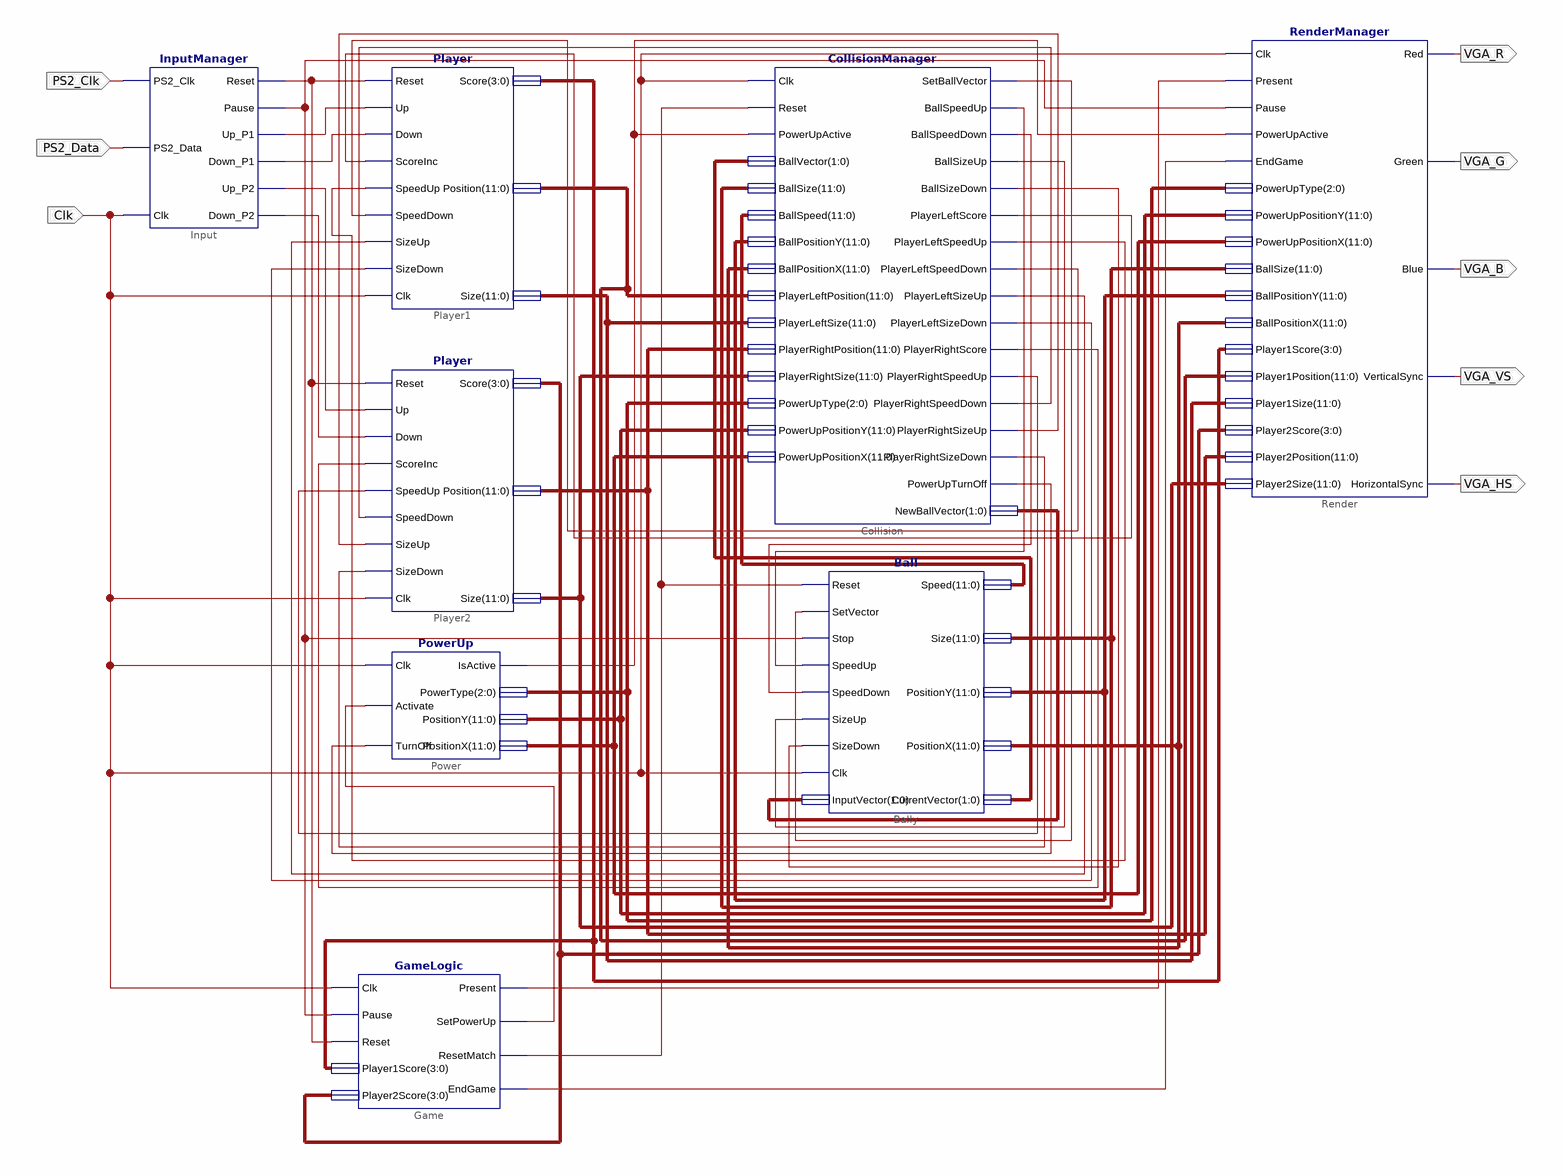
[diagram p0: schematic sheet 1]
// Xilinx ISE schematic pong.sch (spartan3e) as structural Verilog: 8 symbols, 8 ports
module pong (
  input  PS2_Clk,
  input  PS2_Data,
  input  Clk,
  output VGA_VS,
  output VGA_HS,
  output VGA_R,
  output VGA_G,
  output VGA_B
);

  wire XLXN_157, XLXN_158, XLXN_170, XLXN_182, XLXN_183, XLXN_184, XLXN_185, XLXN_188, XLXN_191, XLXN_194,
       XLXN_195, XLXN_196, XLXN_198, XLXN_199, XLXN_200, XLXN_201, XLXN_202, XLXN_203, XLXN_204, XLXN_205,
       XLXN_206, XLXN_207, XLXN_209, XLXN_210, XLXN_211, XLXN_212, XLXN_213;
  wire [1:0] XLXN_197, XLXN_214;
  wire [2:0] XLXN_216;
  wire [3:0] XLXN_233, XLXN_239;
  wire [11:0] XLXN_215, XLXN_217, XLXN_218, XLXN_220, XLXN_222, XLXN_224, XLXN_230, XLXN_232, XLXN_235,
       XLXN_238;

  InputManager Input (
    .PS2_Clk(PS2_Clk), .PS2_Data(PS2_Data), .Clk(Clk), .Reset(XLXN_185), .Pause(XLXN_184), .Up_P1(XLXN_157),
    .Down_P1(XLXN_158), .Up_P2(XLXN_182), .Down_P2(XLXN_183));
  Player Player1 (
    .Reset(XLXN_185), .Up(XLXN_157), .Down(XLXN_158), .ScoreInc(XLXN_209), .SpeedUp(XLXN_210),
    .SpeedDown(XLXN_207), .SizeUp(XLXN_206), .SizeDown(XLXN_205), .Clk(Clk), .Score(XLXN_239),
    .Position(XLXN_238), .Size(XLXN_235));
  Player Player2 (
    .Reset(XLXN_185), .Up(XLXN_182), .Down(XLXN_183), .ScoreInc(XLXN_204), .SpeedUp(XLXN_203),
    .SpeedDown(XLXN_202), .SizeUp(XLXN_201), .SizeDown(XLXN_200), .Clk(Clk), .Score(XLXN_233),
    .Position(XLXN_232), .Size(XLXN_230));
  PowerUp Power (
    .Clk(Clk), .Activate(XLXN_170), .TurnOff(XLXN_199), .IsActive(XLXN_191), .PowerType(XLXN_216),
    .PositionY(XLXN_217), .PositionX(XLXN_218));
  Ball Bally (
    .Reset(XLXN_188), .SetVector(XLXN_196), .Stop(XLXN_184), .SpeedUp(XLXN_195), .SpeedDown(XLXN_194),
    .SizeUp(XLXN_198), .SizeDown(XLXN_211), .Clk(Clk), .InputVector(XLXN_197), .Speed(XLXN_215),
    .Size(XLXN_220), .PositionY(XLXN_222), .PositionX(XLXN_224), .CurrentVector(XLXN_214));
  GameLogic Game (
    .Clk(Clk), .Pause(XLXN_184), .Reset(XLXN_185), .Player1Score(XLXN_239), .Player2Score(XLXN_233),
    .Present(XLXN_212), .SetPowerUp(XLXN_170), .ResetMatch(XLXN_188), .EndGame(XLXN_213));
  CollisionManager Collision (
    .Clk(Clk), .Reset(XLXN_188), .PowerUpActive(XLXN_191), .BallVector(XLXN_214), .BallSize(XLXN_220),
    .BallSpeed(XLXN_215), .BallPositionY(XLXN_222), .BallPositionX(XLXN_224), .PlayerLeftPosition(XLXN_238),
    .PlayerLeftSize(XLXN_235), .PlayerRightPosition(XLXN_232), .PlayerRightSize(XLXN_230),
    .PowerUpType(XLXN_216), .PowerUpPositionY(XLXN_217), .PowerUpPositionX(XLXN_218),
    .SetBallVector(XLXN_196), .BallSpeedUp(XLXN_195), .BallSpeedDown(XLXN_194), .BallSizeUp(XLXN_198),
    .BallSizeDown(XLXN_211), .PlayerLeftScore(XLXN_209), .PlayerLeftSpeedUp(XLXN_210),
    .PlayerLeftSpeedDown(XLXN_207), .PlayerLeftSizeUp(XLXN_206), .PlayerLeftSizeDown(XLXN_205),
    .PlayerRightScore(XLXN_204), .PlayerRightSpeedUp(XLXN_203), .PlayerRightSpeedDown(XLXN_202),
    .PlayerRightSizeUp(XLXN_201), .PlayerRightSizeDown(XLXN_200), .PowerUpTurnOff(XLXN_199),
    .NewBallVector(XLXN_197));
  RenderManager Render (
    .Clk(Clk), .Present(XLXN_212), .Pause(XLXN_184), .PowerUpActive(XLXN_191), .EndGame(XLXN_213),
    .PowerUpType(XLXN_216), .PowerUpPositionY(XLXN_217), .PowerUpPositionX(XLXN_218), .BallSize(XLXN_220),
    .BallPositionY(XLXN_222), .BallPositionX(XLXN_224), .Player1Score(XLXN_239), .Player1Position(XLXN_238),
    .Player1Size(XLXN_235), .Player2Score(XLXN_233), .Player2Position(XLXN_232), .Player2Size(XLXN_230),
    .Red(VGA_R), .Green(VGA_G), .Blue(VGA_B), .VerticalSync(VGA_VS), .HorizontalSync(VGA_HS));
endmodule
